# EAGLE design Self_Balancing_bot (EAGLE 9.6.2)
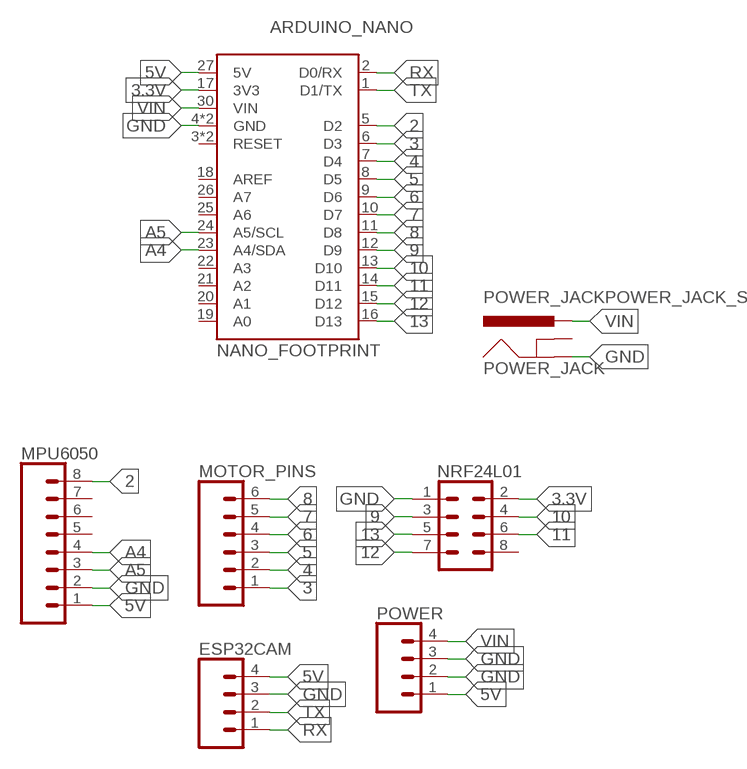
[diagram p0: schematic, sheet 1]

## Parts
ARDUINO_NANO  NANO_FOOTPRINT  [NANO]
ESP32CAM  CONN_04PTH  [1X04]
MOTOR_PINS  CONN_06SILK_FEMALE_PTH  [1X06]
MPU6050  CONN_08"  [1X08]
NRF24L01  CONN_04X2  [2X4]
POWER  CONN_04PTH  [1X04]
POWER_JACK  POWER_JACKPOWER_JACK_SLOT  [POWER_JACK_PTH_SLOT]

## Nets
2: ARDUINO_NANO.5(D2) MPU6050.8
3: ARDUINO_NANO.6(D3) MOTOR_PINS.1
3.3V: ARDUINO_NANO.17(3V3) NRF24L01.2
4: ARDUINO_NANO.7(D4) MOTOR_PINS.2
5: ARDUINO_NANO.8(D5) MOTOR_PINS.3
5V: ARDUINO_NANO.27(5V) ESP32CAM.4 MPU6050.1 POWER.1
6: ARDUINO_NANO.9(D6) MOTOR_PINS.4
7: ARDUINO_NANO.10(D7) MOTOR_PINS.5
8: ARDUINO_NANO.11(D8) MOTOR_PINS.6
9: ARDUINO_NANO.12(D9) NRF24L01.3
10: ARDUINO_NANO.13(D10) NRF24L01.4
11: ARDUINO_NANO.14(D11) NRF24L01.6
12: ARDUINO_NANO.15(D12) NRF24L01.7
13: ARDUINO_NANO.16(D13) NRF24L01.5
A4: ARDUINO_NANO.23(A4/SDA) MPU6050.4
A5: ARDUINO_NANO.24(A5/SCL) MPU6050.3
GND: ARDUINO_NANO.4(GND) ARDUINO_NANO.29(GND) ESP32CAM.3 MPU6050.2 NRF24L01.1 POWER.2 POWER.3 POWER_JACK.GND
RX: ARDUINO_NANO.2(D0/RX) ESP32CAM.1
TX: ARDUINO_NANO.1(D1/TX) ESP32CAM.2
VIN: ARDUINO_NANO.30(VIN) POWER.4 POWER_JACK.PWR
Unconnected: ARDUINO_NANO.3(RESET) ARDUINO_NANO.18(AREF) ARDUINO_NANO.19(A0) ARDUINO_NANO.20(A1) ARDUINO_NANO.21(A2) ARDUINO_NANO.22(A3) ARDUINO_NANO.25(A6) ARDUINO_NANO.26(A7) ARDUINO_NANO.28(RESET) MPU6050.5 MPU6050.6 MPU6050.7 NRF24L01.8 POWER_JACK.GNDBREAK

## Library data of the parts
ARDUINO_NANO = SparkFun-Boards:NANO_FOOTPRINT: Generic Nano Footprint
ESP32CAM POWER = SparkFun-Connectors:CONN_04: Multi connection point. Often used as Generic Header-pin footprint for 0.1 inch spaced/style header connections On any of the 0.1 inch spaced packages, you can populate with these: Break Away Headers - Straight <https://www.sparkfun.com/products/116> (PRT-00116) Break Away Male Headers - Right Angle <https://www.sparkfun.com/products/553> (PRT-00553) Female Headers <https://www.sparkfun.com/products/115> (PRT-00115) Break Away Headers - Machine Pin <https://www.sparkfun.com/products/117> (PRT-00117) Break Away Female Headers - Swiss Machine Pin <https://www.sparkfun.com/products/743> (PRT-00743) For SCREWTERMINALS and SPRING TERMINALS visit here: Screw Terimnals on SparkFun.com <https://www.sparkfun.com/search/results?term=Screw+Terminals> (5mm/3.5mm/2.54mm spacing) This device is also useful as a general connection point to wire up your design to another part of your project. Our various solder wires solder well into these plated through hole pads. Hook-Up Wire - Assortment (Stranded, 22 AWG) <https://www.sparkfun.com/products/11375> (PRT-11375) Hook-Up Wire - Assortment (Solid Core, 22 AWG) <https://www.sparkfun.com/products/11367> (PRT-11367) View the entire wire category on our website here <https://www.sparkfun.com/categories/141> Special notes: Molex polarized connector foot print use with SKU : PRT-08231 with associated crimp pins and housings. 1MM SMD Version SKU: PRT-10208; PROD_ID: CONN-09696
MOTOR_PINS = SparkFun-Connectors:CONN_06: Multi connection point. Often used as Generic Header-pin footprint for 0.1 inch spaced/style header connections On any of the 0.1 inch spaced packages, you can populate with these: Break Away Headers - Straight <https://www.sparkfun.com/products/116> (PRT-00116) Break Away Male Headers - Right Angle <https://www.sparkfun.com/products/553> (PRT-00553) Female Headers <https://www.sparkfun.com/products/115> (PRT-00115) Break Away Headers - Machine Pin <https://www.sparkfun.com/products/117> (PRT-00117) Break Away Female Headers - Swiss Machine Pin <https://www.sparkfun.com/products/743> (PRT-00743) Arduino Stackable Header - 6 Pin <https://www.sparkfun.com/products/9280> (PRT-09280) Screw Terminals 2.54mm Pitch (6-Pin) <https://www.sparkfun.com/products/16499> (PRT-16499) For SCREWTERMINALS and SPRING TERMINALS visit here: Screw Terimnals on SparkFun.com <https://www.sparkfun.com/search/results?term=Screw+Terminals> (5mm/3.5mm/2.54mm spacing) This device is also useful as a general connection point to wire up your design to another part of your project. Our various solder wires solder well into these plated through hole pads. Hook-Up Wire - Assortment (Stranded, 22 AWG) <https://www.sparkfun.com/products/11375> (PRT-11375) Hook-Up Wire - Assortment (Solid Core, 22 AWG) <https://www.sparkfun.com/products/11367> (PRT-11367) View the entire wire category on our website here <https://www.sparkfun.com/categories/141>; PROD_ID: CONN-08437
MPU6050 = SparkFun-Connectors:CONN_08: Multi connection point. Often used as Generic Header-pin footprint for 0.1 inch spaced/style header connections On any of the 0.1 inch spaced packages, you can populate with these: Break Away Headers - Straight <https://www.sparkfun.com/products/116> (PRT-00116) Break Away Male Headers - Right Angle <https://www.sparkfun.com/products/553> (PRT-00553) Female Headers <https://www.sparkfun.com/products/115> (PRT-00115) Break Away Headers - Machine Pin <https://www.sparkfun.com/products/117> (PRT-00117) Break Away Female Headers - Swiss Machine Pin <https://www.sparkfun.com/products/743> (PRT-00743) Arduino Stackable Header - 8 Pin <https://www.sparkfun.com/products/9279> (PRT-09279) For SCREWTERMINALS and SPRING TERMINALS visit here: Screw Terimnals on SparkFun.com <https://www.sparkfun.com/search/results?term=Screw+Terminals> (5mm/3.5mm/2.54mm spacing) This device is also useful as a general connection point to wire up your design to another part of your project. Our various solder wires solder well into these plated through hole pads. Hook-Up Wire - Assortment (Stranded, 22 AWG) <https://www.sparkfun.com/products/11375> (PRT-11375) Hook-Up Wire - Assortment (Solid Core, 22 AWG) <https://www.sparkfun.com/products/11367> (PRT-11367) View the entire wire category on our website here <https://www.sparkfun.com/categories/141> Special notes: Molex polarized connector foot print use with SKU : PRT-08231 with associated crimp pins and housings. 1MM SMD Version SKU: PRT-10208 NOTES ON THE VARIANTS LOCK and LOCK_LONGPADS... This footprint was designed to help hold the alignment of a through-hole component (i.e. 6-pin header) while soldering it into place. You may notice that each hole has been shifted either up or down by 0.005 of an inch from it's more standard position (which is a perfectly straight line). This slight alteration caused the pins (the squares in the middle) to touch the edges of the holes. Because they are alternating, it causes a "brace" to hold the component in place. 0.005 has proven to be the perfect amount of "off-center" position when using our standard breakaway headers. Although looks a little odd when you look at the bare footprint, once you have a header in there, the alteration is very hard to notice. Also,if you push a header all the way into place, it is covered up entirely on the bottom side.; PROD_ID: CONN-08438
NRF24L01 = SparkFun-Connectors:CONN_04X2: Multi connection point. Often used as Generic Header-pin footprint for 0.1 inch spaced/style header connections On any of the 0.1 inch spaced packages, you can populate with these: Break Away Headers - Straight <https://www.sparkfun.com/products/116> (PRT-00116) Break Away Male Headers - Right Angle <https://www.sparkfun.com/products/553> (PRT-00553) Female Headers <https://www.sparkfun.com/products/115> (PRT-00115) Break Away Headers - Machine Pin <https://www.sparkfun.com/products/117> (PRT-00117) Break Away Female Headers - Swiss Machine Pin <https://www.sparkfun.com/products/743> (PRT-00743)
POWER_JACK = SparkFun-Connectors:POWER_JACK: Power Jack Connector This is the standard 5.5mm barrel jack for power. The PTH is the most common, proven, reliable, footprint. The Slot footprint only works if the mill layer is transmitted to the PCB fab house so be warned. Here are the connectors we sell at SparkFun: DC Barrel Power Jack/Connector <https://www.sparkfun.com/products/119> (PRT-00119) DC Barrel Power Jack/Connector (SMD) <https://www.sparkfun.com/products/12748> (PRT-12748) DC Barrel Jack Adapter - Breadboard Compatible <https://www.sparkfun.com/products/10811> (PRT-10811) It is used on this SparkFun product (and many, many others): SparkFun RedBoard - Programmed with Arduino <https://www.sparkfun.com/products/12757> (DEV-12757) Also, if you need a mating power supply or connector, please check these out: Wall Adapter Power Supply - 9VDC 650mA <https://www.sparkfun.com/products/298> (TOL-00298) DC Barrel Jack Adapter - Male <https://www.sparkfun.com/products/10287> (PRT-10287); PROD_ID: CONN-08197

## Board
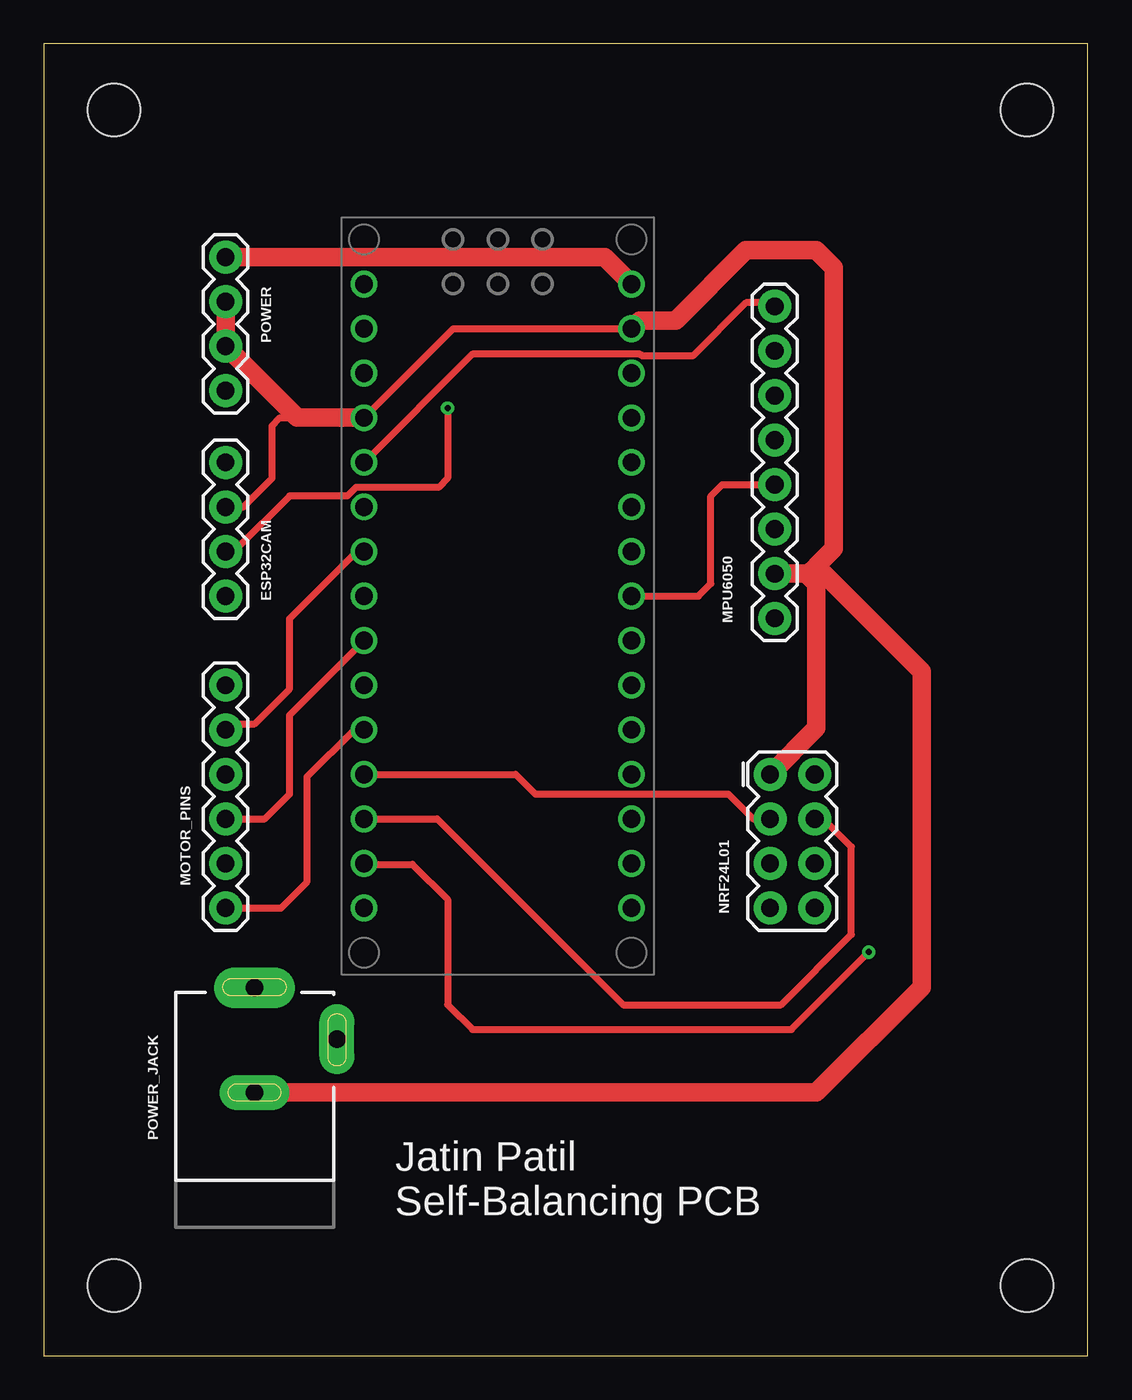
[diagram p1: board, top side]
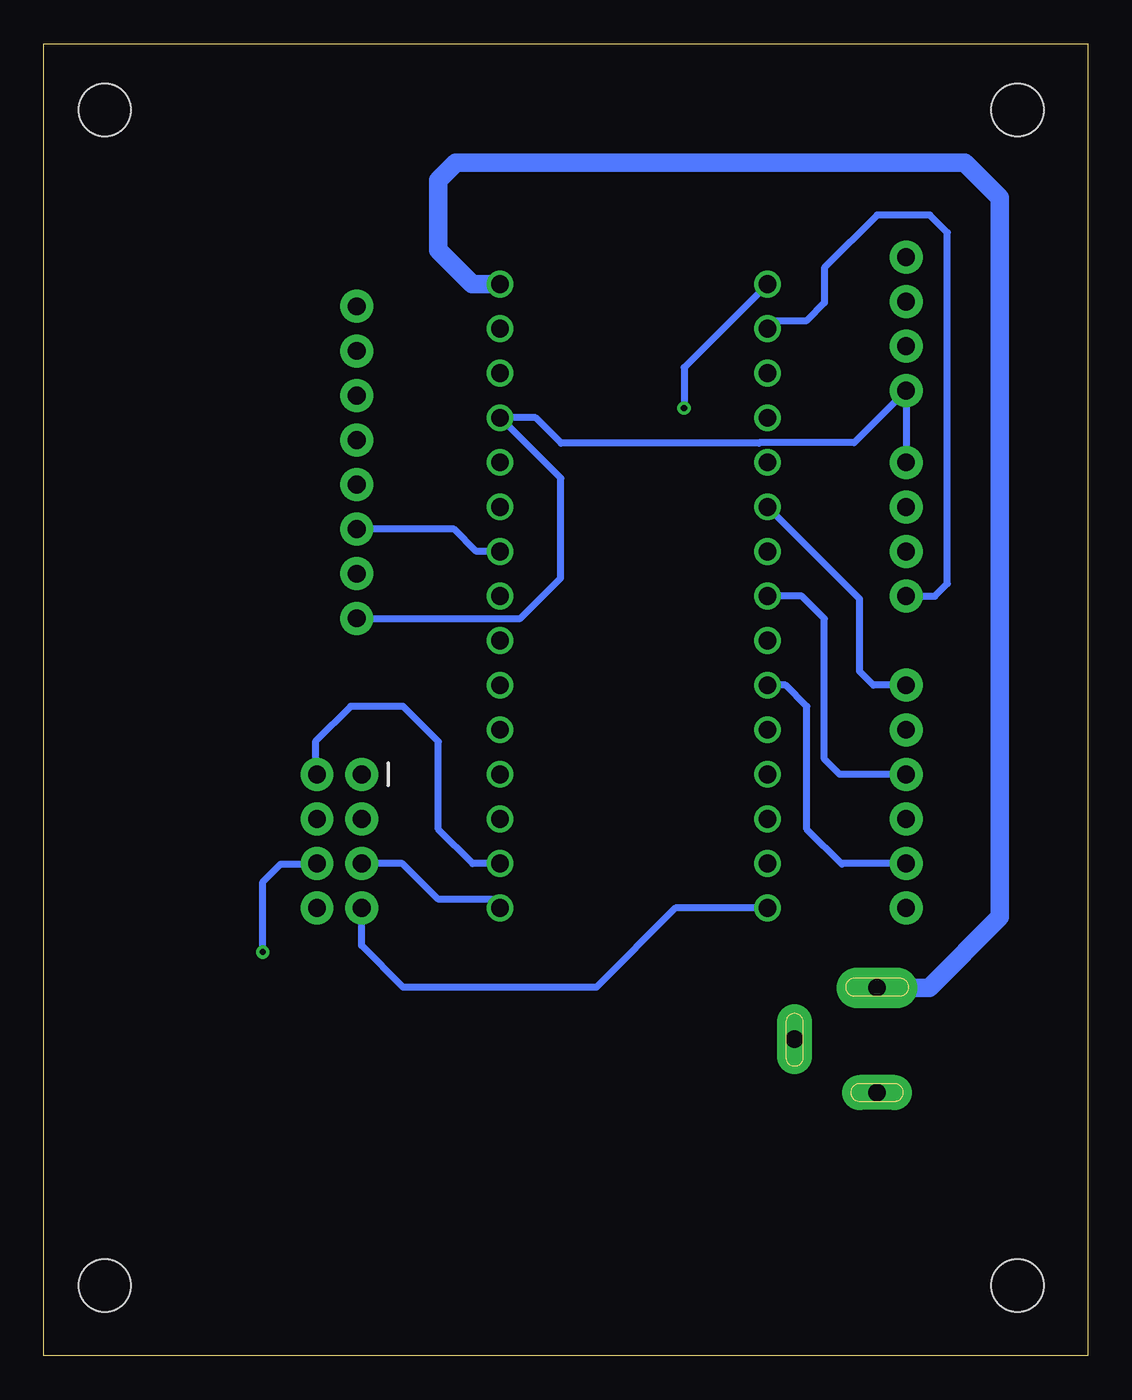
[diagram p2: board, bottom side, seen from below]

Size 59.47 x 74.76 mm. Coordinates in mm from the lower left corner, seen from the top.
Outline: 0,0 59.47,0 59.47,74.76 0,74.76 0,0
Copper layers (1*16): Top 0.035mm / dielectric 1.5mm / Bottom 0.035mm
Design rules "default": minimum track width 6mil, minimum drill 0.35mm, track to track 6mil, track to pad 6mil, pad to pad 6mil, via to via 6mil, smd to smd 6mil, copper to edge 40mil, drill to drill 6mil, minimum pad ring 10mil, minimum via ring 8mil, stop-mask expansion 4mil, vias tented up to drill 0mil, thermal gap 10mil
Holes 3 mm at 4,4 56,4 56,71 4,71

### Footprints (pad centres in the part's own frame; a part is rotated, then mirrored left to right if it is on the bottom)
NANO = drill 1.016: 1 -7.62,17.78; 2 -7.62,15.24; 3 -7.62,12.7; 4 -7.62,10.16; 5 -7.62,7.62; 6 -7.62,5.08; 7 -7.62,2.54; 8 -7.62,0; 9 -7.62,-2.54; 10 -7.62,-5.08; 11 -7.62,-7.62; 12 -7.62,-10.16; 13 -7.62,-12.7; 14 -7.62,-15.24; 15 -7.62,-17.78; 16 7.62,-17.78; 17 7.62,-15.24; 18 7.62,-12.7; 19 7.62,-10.16; 20 7.62,-7.62; 21 7.62,-5.08; 22 7.62,-2.54; 23 7.62,0; 24 7.62,2.54; 25 7.62,5.08; 26 7.62,7.62; 27 7.62,10.16; 28 7.62,12.7; 29 7.62,15.24; 30 7.62,17.78
1X04 = drill 1.016 pad 1.88: 1 0,0; 2 2.54,0; 3 5.08,0; 4 7.62,0
1X06 = drill 1.016 pad 1.88: 1 0,0; 2 2.54,0; 3 5.08,0; 4 7.62,0; 5 10.16,0; 6 12.7,0
1X08 = drill 1.016 pad 1.88: 1 0,0; 2 2.54,0; 3 5.08,0; 4 7.62,0; 5 10.16,0; 6 12.7,0; 7 15.24,0; 8 17.78,0
2X4 = drill 1.016 pad 1.88: 1 -3.81,-1.27; 2 -3.81,1.27; 3 -1.27,-1.27; 4 -1.27,1.27; 5 1.27,-1.27; 6 1.27,1.27; 7 3.81,-1.27; 8 3.81,1.27
POWER_JACK_PTH_SLOT = drill 1 pad 2 long: GND 0,0; GNDBREAK -3.048,4.699 | drill 1 pad 2.3 long: PWR -5.969,0

### Placement (x,y rotation side)
ARDUINO_NANO  25.86,43.29 0 top
ESP32CAM  10.35,43.29 90 top
MOTOR_PINS  10.35,38.21 270 top
MPU6050  41.64,42.02 90 top
NRF24L01  42.64,29.32 270 top
POWER  10.35,54.99 90 top
POWER_JACK  12,15 270 top

### Tracks (layer width: path | path; a pad name or v marks a point on that pad's centre or on a via)
2
  Top 0.4: ARDUINO_NANO.5 24.43,57.1 33.94,57.1 34.05,57 37,57 40,60 41,60 41.2,59.8 MPU6050.8
3
  Bottom 0.4: MOTOR_PINS.1 12.21,38.21 13,39 13,43.13 ARDUINO_NANO.6
3.3V
  Bottom 0.4: ARDUINO_NANO.17 35.05,28.05 37,30 37,35 39,37 42,37 44,35 44,33.22 NRF24L01.2
4
  Top 0.4: MOTOR_PINS.2 10.68,36 12,36 14,38 14,42 17.83,45.83 ARDUINO_NANO.7
5
  Bottom 0.4: MOTOR_PINS.3 14.13,33.13 15,34 15,42 16.29,43.29 ARDUINO_NANO.8
5V
  Bottom 0.4: 30.03,50 ARDUINO_NANO.27 31.45,53.45 30,52 18.73,52 18.7,52.02 13.32,52.02 POWER.1 ESP32CAM.4 | 30.03,50 30,50 | MPU6050.1 32.32,42.02 30.03,44.31 30.03,50
6
  Top 0.4: MOTOR_PINS.4 12.59,30.59 14,32 14,36.51 ARDUINO_NANO.9
7
  Bottom 0.4: MOTOR_PINS.5 13.95,28.05 14,28 16,30 16,37 17.21,38.21 ARDUINO_NANO.10
8
  Top 0.4: MOTOR_PINS.6 13.51,25.51 15,27 15,33 17.67,35.67 ARDUINO_NANO.11
9
  Top 0.4: ARDUINO_NANO.12 26.87,33.13 28,32 39,32 40.41,30.59 NRF24L01.3
10
  Top 0.4: ARDUINO_NANO.13 22.41,30.59 33,20 42,20 46,24 46,29 44.41,30.59 NRF24L01.4
11  (via drill 0.35)
  Top 0.4: ARDUINO_NANO.14 18.29,28 21,28 23,26 23,20 24.42,18.58 42.58,18.58 v47,23
  Bottom 0.4: NRF24L01.6 43.96,28 46,28 47,27 v47,23
12
  Bottom 0.4: ARDUINO_NANO.15 23.49,25.51 28,21 39,21 41.37,23.37 NRF24L01.7
13
  Bottom 0.4: ARDUINO_NANO.16 33.97,26 37,26 39.05,28.05 NRF24L01.5
A4
  Top 0.4: ARDUINO_NANO.23 37.29,43.29 38,44 38,49 38.64,49.64 MPU6050.4
A5
  Bottom 0.4: ARDUINO_NANO.24 34.83,45.83 36.1,47.1 MPU6050.3
GND
  Top 0.4: ARDUINO_NANO.29 23.32,58.53 ARDUINO_NANO.4 13.45,53.45 13,53 13,50 11.37,48.37 ESP32CAM.3
  Top 1.04: POWER.3 POWER.2 14.43,53.45 ARDUINO_NANO.4 | ARDUINO_NANO.29 33.95,59 36,59 40,63 44,63 45,62 45,46 44,45 | 44,45 43.56,44.56 MPU6050.2 43.44,44.56 44,44 44,35.76 NRF24L01.1 | POWER_JACK.GND 44,15 50,21 50,39 44,45
RX
  Bottom 0.4: ESP32CAM.1 8.71,43.29 8,44 8,64 9,65 12,65 15,62 15,60 16,59 18,59 18,58.77 ARDUINO_NANO.2
TX  (via drill 0.35)
  Top 0.4: v23,54 23,50 22.48,49.48 17.78,49.48 17.29,49 14,49 11,46 10.52,46 ESP32CAM.2
  Bottom 0.4: ARDUINO_NANO.1 23,56.31 v23,54
VIN
  Top 1.04: POWER.4 31.94,62.61 ARDUINO_NANO.30
  Bottom 1.04: POWER_JACK.PWR 9.03,20.97 5,25 5,66 7,68 36,68 37,67 37,63 35.07,61.07 ARDUINO_NANO.30

### Text on the board
tNames: Jatin Patil / Self-Balancing PCB